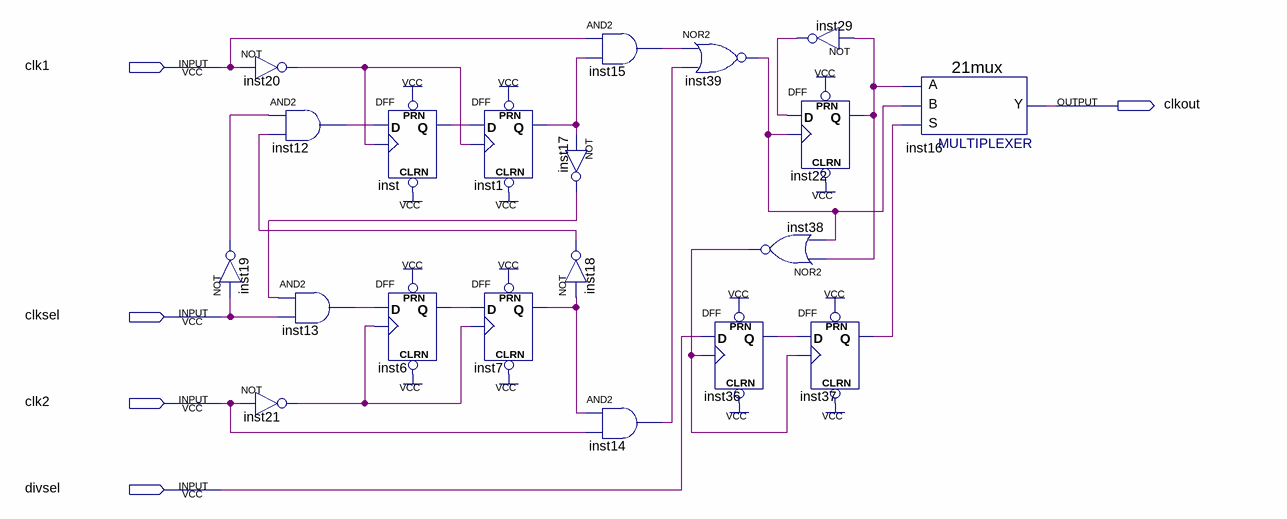
[diagram p0: schematic sheet]
// Quartus schematic clocker.bdf as structural Verilog: 20 symbols, 5 pins
module clocker (
  input  clk1,
  input  clksel,
  input  clk2,
  input  divsel,
  output clkout
);

  wire inst1_q, inst6_q, inst7_q, inst12_out, inst13_out, inst14_out, inst15_out, inst17_out, inst18_out,
       inst19_out, inst20_out, inst21_out, inst22_q, inst29_out, inst36_q, inst37_q, inst38_out, inst39_out,
       inst_q;

  not inst19 (inst19_out, clksel);
  not inst20 (inst20_out, clk1);
  and inst12 (inst12_out, inst19_out, inst18_out);
  and inst13 (inst13_out, inst17_out, clksel);
  not inst21 (inst21_out, clk2);
  DFF inst (.CLRN(1'b1), .CLK(inst20_out), .D(inst12_out), .PRN(1'b1), .Q(inst_q));
  DFF inst6 (.CLRN(1'b1), .CLK(inst21_out), .D(inst13_out), .PRN(1'b1), .Q(inst6_q));
  DFF inst1 (.CLRN(1'b1), .CLK(inst20_out), .D(inst_q), .PRN(1'b1), .Q(inst1_q));
  DFF inst7 (.CLRN(1'b1), .CLK(inst21_out), .D(inst6_q), .PRN(1'b1), .Q(inst7_q));
  and inst15 (inst15_out, clk1, inst1_q);
  not inst17 (inst17_out, inst1_q);
  not inst18 (inst18_out, inst7_q);
  and inst14 (inst14_out, inst7_q, clk2);
  nor inst39 (inst39_out, inst15_out, inst14_out);
  nor inst38 (inst38_out, inst22_q, inst39_out);
  DFF inst36 (.CLRN(1'b1), .CLK(inst38_out), .D(divsel), .PRN(1'b1), .Q(inst36_q));
  not inst29 (inst29_out, inst22_q);
  DFF inst22 (.CLRN(1'b1), .CLK(inst39_out), .D(inst29_out), .PRN(1'b1), .Q(inst22_q));
  DFF inst37 (.CLRN(1'b1), .CLK(inst38_out), .D(inst36_q), .PRN(1'b1), .Q(inst37_q));
  \21mux  inst16 (.S(inst37_q), .B(inst39_out), .A(inst22_q), .Y(clkout));
endmodule
